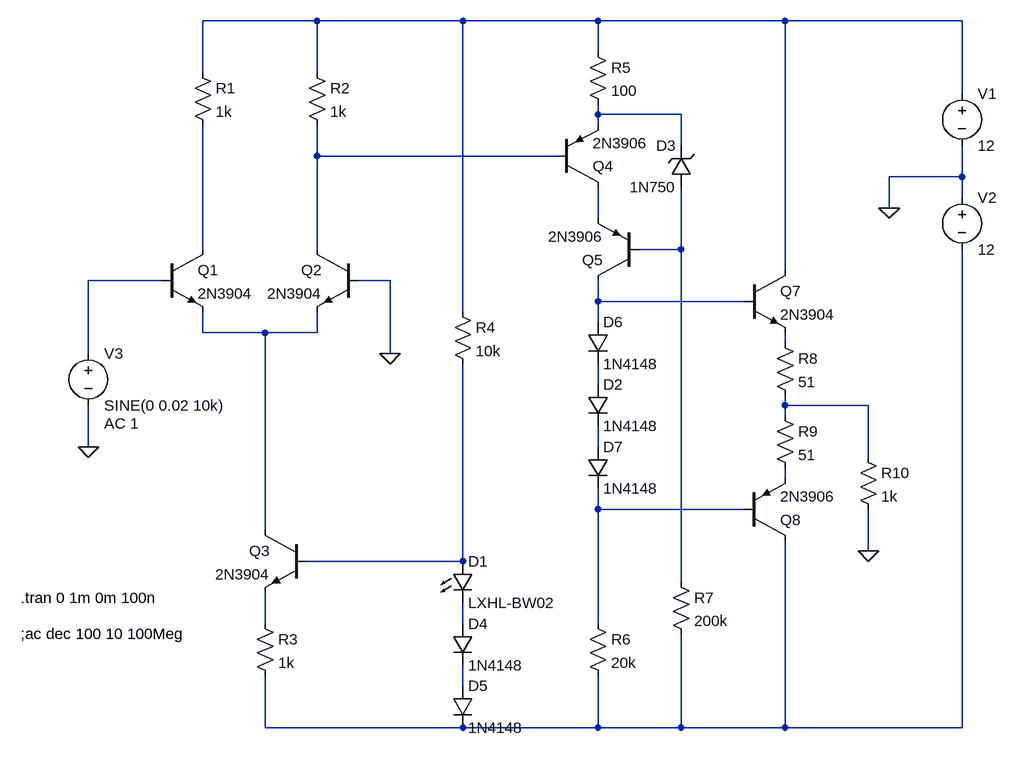
[diagram p0: schematic op1.asc]
op1.asc, the LTspice schematic file:
Version 4
SHEET 1 1228 688
WIRE 176 -416 0 -416
WIRE 400 -416 176 -416
WIRE 608 -416 400 -416
WIRE 896 -416 608 -416
WIRE 1168 -416 896 -416
WIRE 608 -368 608 -416
WIRE 0 -336 0 -416
WIRE 176 -336 176 -416
WIRE 1168 -304 1168 -416
WIRE 608 -272 608 -288
WIRE 736 -272 608 -272
WIRE 608 -256 608 -272
WIRE 736 -224 736 -272
WIRE 176 -208 176 -256
WIRE 544 -208 176 -208
WIRE 1168 -176 1168 -224
WIRE 1168 -176 1056 -176
WIRE 1168 -144 1168 -176
WIRE 1056 -128 1056 -176
WIRE 608 -112 608 -160
WIRE 0 -64 0 -256
WIRE 176 -64 176 -208
WIRE 736 -64 736 -160
WIRE 736 -64 672 -64
WIRE 896 -32 896 -416
WIRE -64 -16 -176 -16
WIRE 288 -16 240 -16
WIRE 608 16 608 -16
WIRE 832 16 608 16
WIRE 400 32 400 -416
WIRE 608 48 608 16
WIRE 0 64 0 32
WIRE 96 64 0 64
WIRE 176 64 176 32
WIRE 176 64 96 64
WIRE 896 80 896 64
WIRE -176 96 -176 -16
WIRE 288 96 288 -16
WIRE 608 144 608 112
WIRE 896 176 896 160
WIRE 1024 176 896 176
WIRE 896 192 896 176
WIRE -176 240 -176 176
WIRE 608 240 608 208
WIRE 1024 256 1024 176
WIRE 896 288 896 272
WIRE 608 336 608 304
WIRE 832 336 608 336
WIRE 96 368 96 64
WIRE 1024 400 1024 336
WIRE 400 416 400 112
WIRE 400 416 160 416
WIRE 736 448 736 -64
WIRE 96 512 96 464
WIRE 400 512 400 480
WIRE 608 512 608 336
WIRE 400 608 400 576
WIRE 96 672 96 592
WIRE 400 672 96 672
WIRE 608 672 608 592
WIRE 608 672 400 672
WIRE 736 672 736 528
WIRE 736 672 608 672
WIRE 896 672 896 384
WIRE 896 672 736 672
WIRE 1168 672 1168 -64
WIRE 1168 672 896 672
FLAG 1024 400 0
FLAG 1056 -128 0
FLAG 288 96 0
FLAG -176 240 0
SYMBOL npn -64 -64 R0
SYMATTR InstName Q1
SYMATTR Value 2N3904
SYMBOL npn 240 -64 M0
SYMATTR InstName Q2
SYMATTR Value 2N3904
SYMBOL res -16 -352 R0
SYMATTR InstName R1
SYMATTR Value 1k
SYMBOL res 160 -352 R0
SYMATTR InstName R2
SYMATTR Value 1k
SYMBOL npn 160 368 M0
SYMATTR InstName Q3
SYMATTR Value 2N3904
SYMBOL res 80 496 R0
SYMATTR InstName R3
SYMATTR Value 1k
SYMBOL res 384 16 R0
SYMATTR InstName R4
SYMATTR Value 10k
SYMBOL LED 384 416 R0
SYMATTR InstName D1
SYMATTR Value LXHL-BW02
SYMATTR Description Diode
SYMATTR Type diode
SYMBOL res 592 -384 R0
SYMATTR InstName R5
SYMATTR Value 100
SYMBOL pnp 544 -160 M180
SYMATTR InstName Q4
SYMATTR Value 2N3906
SYMBOL pnp 672 -16 R180
SYMATTR InstName Q5
SYMATTR Value 2N3906
SYMBOL diode 592 144 R0
SYMATTR InstName D2
SYMATTR Value 1N4148
SYMBOL res 592 496 R0
SYMATTR InstName R6
SYMATTR Value 20k
SYMBOL zener 752 -160 R180
WINDOW 0 24 64 Left 2
WINDOW 3 24 0 Left 2
SYMATTR InstName D3
SYMATTR Value 1N750
SYMATTR Description Diode
SYMATTR Type diode
SYMBOL res 720 432 R0
SYMATTR InstName R7
SYMATTR Value 200k
SYMBOL npn 832 -32 R0
SYMATTR InstName Q7
SYMATTR Value 2N3904
SYMBOL pnp 832 384 M180
SYMATTR InstName Q8
SYMATTR Value 2N3906
SYMBOL res 880 64 R0
SYMATTR InstName R8
SYMATTR Value 51
SYMBOL res 880 176 R0
SYMATTR InstName R9
SYMATTR Value 51
SYMBOL diode 384 512 R0
SYMATTR InstName D4
SYMATTR Value 1N4148
SYMBOL diode 384 608 R0
SYMATTR InstName D5
SYMATTR Value 1N4148
SYMBOL diode 592 48 R0
SYMATTR InstName D6
SYMATTR Value 1N4148
SYMBOL diode 592 240 R0
SYMATTR InstName D7
SYMATTR Value 1N4148
SYMBOL res 1008 240 R0
SYMATTR InstName R10
SYMATTR Value 1k
SYMBOL voltage 1168 -320 R0
WINDOW 123 0 0 Left 2
WINDOW 39 0 0 Left 2
SYMATTR InstName V1
SYMATTR Value 12
SYMBOL voltage 1168 -160 R0
WINDOW 123 0 0 Left 2
WINDOW 39 0 0 Left 2
SYMATTR InstName V2
SYMATTR Value 12
SYMBOL voltage -176 80 R0
WINDOW 123 24 124 Left 2
WINDOW 39 0 0 Left 2
SYMATTR Value2 AC 1
SYMATTR InstName V3
SYMATTR Value SINE(0 0.02 10k)
TEXT -280 472 Left 2 !.tran 0 1m 0m 100n
TEXT -280 528 Left 2 !;ac dec 100 10 100Meg

The netlist it stands for:
* op1.asc
Q1 N005 N007 N009 0 2N3904
Q2 N003 0 N009 0 2N3904
R1 N001 N005 1k
R2 N001 N003 1k
Q3 N009 N016 N017 0 2N3904
R3 N017 N020 1k
R4 N001 N016 10k
D1 N016 N018 LXHL-BW02
R5 N001 N002 100
Q4 N004 N003 N002 0 2N3906
Q5 N008 N006 N004 0 2N3906
D2 N011 N013 1N4148
R6 N015 N020 20k
D3 N006 N002 1N750
R7 N006 N020 200k
Q7 N001 N008 N010 0 2N3904
Q8 N020 N015 N014 0 2N3906
R8 N010 N012 51
R9 N012 N014 51
D4 N018 N019 1N4148
D5 N019 N020 1N4148
D6 N008 N011 1N4148
D7 N013 N015 1N4148
R10 N012 0 1k
V1 N001 0 12
V2 0 N020 12
V3 N007 0 SINE(0 0.02 10k) AC 1
.model D D
.lib standard.dio
.model NPN NPN
.model PNP PNP
.lib standard.bjt
.tran 0 1m 0m 100n
;ac dec 100 10 100Meg
.backanno
.end